# Altium schematic sheet Diode.SchDoc
size A3; SheetNumber: 22; SheetTotal: 41
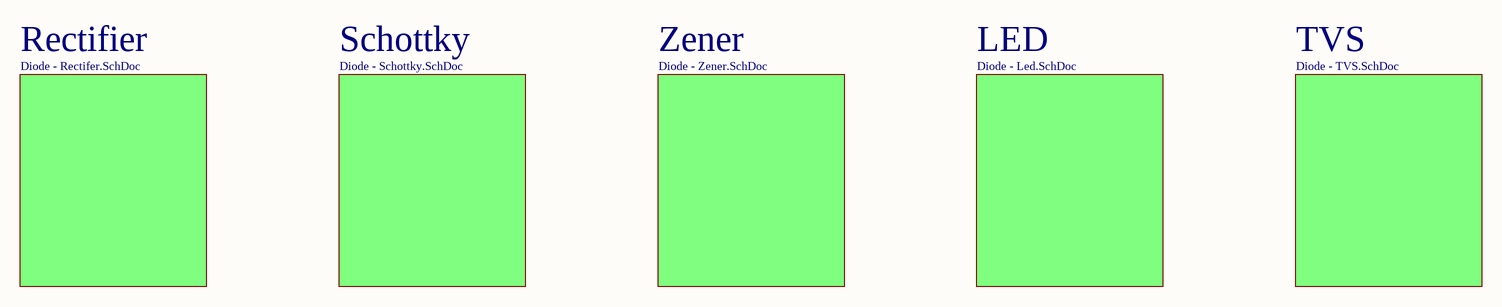
[diagram p0: Diode.SchDoc]

## Sub-sheets
LED = Diode - Led.SchDoc: no entries
Rectifier = Diode - Rectifer.SchDoc: no entries
Schottky = Diode - Schottky.SchDoc: no entries
TVS = Diode - TVS.SchDoc: no entries
Zener = Diode - Zener.SchDoc: no entries